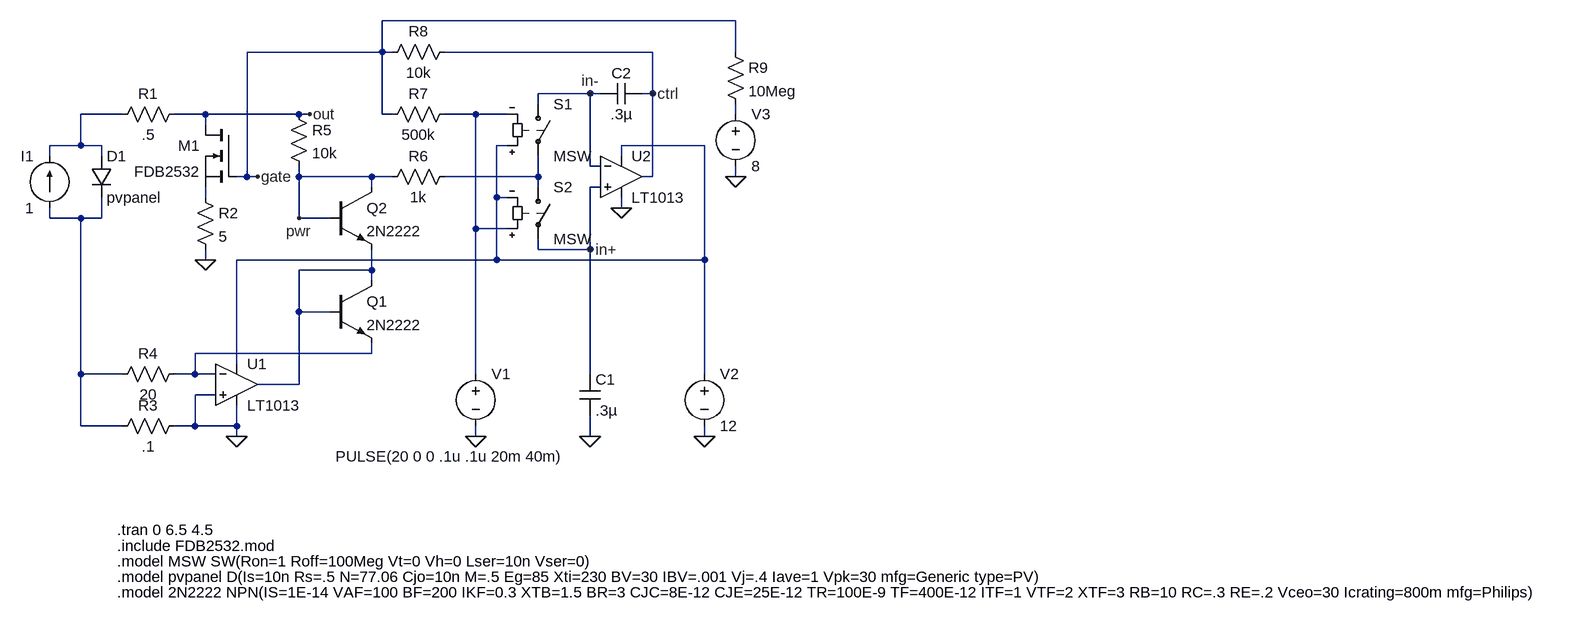
[diagram p0: schematic pvcontroller.asc]
pvcontroller.asc, the LTspice schematic file:
Version 4
SHEET 1 2228 1024
WIRE 992 96 448 96
WIRE 448 144 448 96
WIRE 448 144 240 144
WIRE 464 144 448 144
WIRE 864 144 544 144
WIRE 992 144 992 96
WIRE 768 208 688 208
WIRE 784 208 768 208
WIRE 864 208 864 144
WIRE 864 208 848 208
WIRE 688 224 688 208
WIRE 48 240 -16 240
WIRE 176 240 128 240
WIRE 320 240 176 240
WIRE 336 240 320 240
WIRE 448 240 448 144
WIRE 464 240 448 240
WIRE 592 240 544 240
WIRE 640 240 592 240
WIRE 992 240 992 224
WIRE 176 256 176 240
WIRE -16 288 -16 240
WIRE -16 288 -64 288
WIRE 16 288 -16 288
WIRE 640 288 624 288
WIRE 944 288 816 288
WIRE -64 304 -64 288
WIRE 16 304 16 288
WIRE 816 304 816 288
WIRE 768 320 768 208
WIRE 784 320 768 320
WIRE 240 336 240 144
WIRE 240 336 224 336
WIRE 256 336 240 336
WIRE 320 336 320 320
WIRE 432 336 320 336
WIRE 464 336 432 336
WIRE 688 336 688 304
WIRE 688 336 544 336
WIRE 864 336 864 208
WIRE 864 336 848 336
WIRE 992 336 992 320
WIRE 432 352 432 336
WIRE 688 352 688 336
WIRE 784 352 768 352
WIRE 176 368 176 352
WIRE 624 368 624 288
WIRE 640 368 624 368
WIRE 816 384 816 368
WIRE -64 400 -64 384
WIRE -16 400 -64 400
WIRE 16 400 16 368
WIRE 16 400 -16 400
WIRE 320 400 320 336
WIRE 368 400 320 400
WIRE 592 416 592 240
WIRE 640 416 592 416
WIRE 688 448 688 432
WIRE 768 448 768 352
WIRE 768 448 688 448
WIRE 176 464 176 448
WIRE 624 464 624 368
WIRE 624 464 224 464
WIRE 944 464 944 288
WIRE 944 464 624 464
WIRE 432 480 432 448
WIRE 432 480 320 480
WIRE 432 496 432 480
WIRE 320 544 320 480
WIRE 368 544 320 544
WIRE 432 608 432 592
WIRE 432 608 160 608
WIRE 224 624 224 464
WIRE -16 640 -16 400
WIRE 48 640 -16 640
WIRE 160 640 160 608
WIRE 160 640 128 640
WIRE 192 640 160 640
WIRE 592 640 592 416
WIRE 768 640 768 448
WIRE 944 640 944 464
WIRE 320 656 320 544
WIRE 320 656 256 656
WIRE 192 672 160 672
WIRE -16 720 -16 640
WIRE 48 720 -16 720
WIRE 160 720 160 672
WIRE 160 720 128 720
WIRE 224 720 224 688
WIRE 224 720 160 720
WIRE 224 736 224 720
WIRE 592 736 592 720
WIRE 768 736 768 704
WIRE 944 736 944 720
FLAG 176 464 0
FLAG 224 736 0
FLAG 592 736 0
FLAG 816 384 0
FLAG 768 736 0
FLAG 944 736 0
FLAG 992 336 0
FLAG 336 240 out
FLAG 256 336 gate
FLAG 768 208 in-
FLAG 768 448 in+
FLAG 864 208 ctrl
FLAG 320 400 pwr
SYMBOL current -64 384 R180
WINDOW 0 24 80 Left 2
WINDOW 3 24 0 Left 2
SYMATTR InstName I1
SYMATTR Value 1
SYMBOL Diode 0 304 R0
SYMATTR InstName D1
SYMATTR Value pvpanel
SYMBOL Res 144 224 R90
WINDOW 0 0 56 VBottom 2
WINDOW 3 32 56 VTop 2
SYMATTR InstName R1
SYMATTR Value .5
SYMBOL Res 160 352 R0
SYMATTR InstName R2
SYMATTR Value 5
SYMBOL Res 144 704 R90
WINDOW 0 0 56 VBottom 2
WINDOW 3 32 56 VTop 2
SYMATTR InstName R3
SYMATTR Value .1
SYMBOL OpAmps/LT1013 224 592 R0
SYMATTR InstName U1
SYMBOL Res 144 624 R90
WINDOW 0 0 56 VBottom 2
WINDOW 3 32 56 VTop 2
SYMATTR InstName R4
SYMATTR Value 20
SYMBOL npn 368 496 R0
SYMATTR InstName Q1
SYMATTR Value 2N2222
SYMBOL npn 368 352 R0
SYMATTR InstName Q2
SYMATTR Value 2N2222
SYMBOL Res 304 224 R0
SYMATTR InstName R5
SYMATTR Value 10k
SYMBOL Res 560 320 R90
WINDOW 0 0 56 VBottom 2
WINDOW 3 32 56 VTop 2
SYMATTR InstName R6
SYMATTR Value 1k
SYMBOL Res 560 224 R90
WINDOW 0 0 56 VBottom 2
WINDOW 3 32 56 VTop 2
SYMATTR InstName R7
SYMATTR Value 500k
SYMBOL Res 560 128 R90
WINDOW 0 0 56 VBottom 2
WINDOW 3 32 56 VTop 2
SYMATTR InstName R8
SYMATTR Value 10k
SYMBOL sw 688 208 R0
SYMATTR InstName S1
SYMATTR Value MSW
SYMBOL sw 688 336 R0
SYMATTR InstName S2
SYMATTR Value MSW
SYMBOL OpAmps/LT1013 816 272 R0
SYMATTR InstName U2
SYMBOL voltage 592 624 R0
WINDOW 3 -216 143 Left 2
SYMATTR InstName V1
SYMATTR Value PULSE(20 0 0 .1u .1u 20m 40m)
SYMBOL Cap 752 640 R0
SYMATTR InstName C1
SYMATTR Value .3µ
SYMBOL Cap 848 192 R90
WINDOW 0 0 32 VBottom 2
WINDOW 3 32 32 VTop 2
SYMATTR InstName C2
SYMATTR Value .3µ
SYMBOL voltage 944 624 R0
SYMATTR InstName V2
SYMATTR Value 12
SYMBOL Res 976 128 R0
SYMATTR InstName R9
SYMATTR Value 10Meg
SYMBOL voltage 992 224 R0
SYMATTR InstName V3
SYMATTR Value 8
SYMBOL nmos 224 256 M0
SYMATTR InstName M1
SYMATTR Value FDB2532
TEXT 40 928 Left 2 !.model MSW SW(Ron=1 Roff=100Meg Vt=0 Vh=0 Lser=10n Vser=0)
TEXT 40 952 Left 2 !.model pvpanel D(Is=10n Rs=.5 N=77.06 Cjo=10n M=.5 Eg=85 Xti=230 BV=30 IBV=.001 Vj=.4 Iave=1 Vpk=30 mfg=Generic type=PV)
TEXT 40 976 Left 2 !.model 2N2222 NPN(IS=1E-14 VAF=100 BF=200 IKF=0.3 XTB=1.5 BR=3 CJC=8E-12 CJE=25E-12 TR=100E-9 TF=400E-12 ITF=1 VTF=2 XTF=3 RB=10 RC=.3 RE=.2 Vceo=30 Icrating=800m mfg=Philips)
TEXT 40 904 Left 2 !.include FDB2532.mod
TEXT 40 880 Left 2 !.tran 0 6.5 4.5

The netlist it stands for:
* pvcontroller.asc
I1 N007 N001 1
D1 N001 N007 pvpanel
R1 out N001 .5
R2 N006 0 5
R3 0 N007 .1
XU1 0 N009 N004 0 N008 LT1013  ; pins In+ In- V+ V- OUT
R4 N009 N007 20
Q1 N008 N008 N009 0 2N2222
Q2 pwr pwr N008 0 2N2222
R5 out pwr 10k
R6 N005 pwr 1k
R7 N002 gate 500k
R8 ctrl gate 10k
S1 in- N005 N004 N002 MSW
S2 N005 in+ N002 N004 MSW
XU2 in+ in- N004 0 ctrl LT1013  ; pins In+ In- V+ V- OUT
V1 N002 0 PULSE(20 0 0 .1u .1u 20m 40m)
C1 in+ 0 .3µ
C2 ctrl in- .3µ
V2 N004 0 12
R9 gate N003 10Meg
V3 N003 0 8
M1 out gate N006 N006 FDB2532
.model D D
.lib standard.dio
.model NPN NPN
.model PNP PNP
.lib standard.bjt
.model NMOS NMOS
.model PMOS PMOS
.lib standard.mos
.model MSW SW(Ron=1 Roff=100Meg Vt=0 Vh=0 Lser=10n Vser=0)
.model pvpanel D(Is=10n Rs=.5 N=77.06 Cjo=10n M=.5 Eg=85 Xti=230 BV=30 IBV=.001 Vj=.4 Iave=1 Vpk=30 mfg=Generic type=PV)
.model 2N2222 NPN(IS=1E-14 VAF=100 BF=200 IKF=0.3 XTB=1.5 BR=3 CJC=8E-12 CJE=25E-12 TR=100E-9 TF=400E-12 ITF=1 VTF=2 XTF=3 RB=10 RC=.3 RE=.2 Vceo=30 Icrating=800m mfg=Philips)
.include FDB2532.mod
.tran 0 6.5 4.5
.lib LTC.lib
.backanno
.end